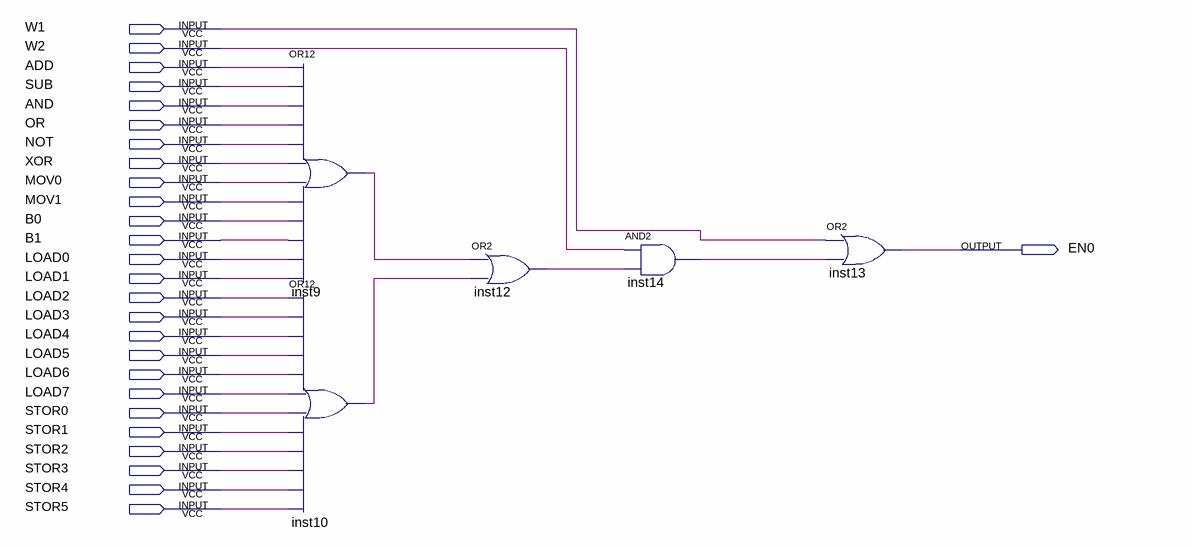
[diagram p0: schematic sheet]
// Quartus schematic EN0.bdf as structural Verilog: 5 symbols, 27 pins
module EN0 (
  input  W1,
  input  W2,
  input  ADD,
  input  SUB,
  input  AND,
  input  OR,
  input  NOT,
  input  XOR,
  input  MOV0,
  input  MOV1,
  input  B0,
  input  B1,
  input  LOAD0,
  input  LOAD1,
  input  LOAD2,
  input  LOAD3,
  input  LOAD4,
  input  LOAD5,
  input  LOAD6,
  input  LOAD7,
  input  STOR0,
  input  STOR1,
  input  STOR2,
  input  STOR3,
  input  STOR4,
  input  STOR5,
  output EN0
);

  wire inst9_out, inst10_out, inst12_out, inst14_out;

  or inst9 (inst9_out, ADD, SUB, AND, OR, NOT, XOR, MOV0, MOV1, B0, B1, LOAD0, LOAD1);
  or inst10 (inst10_out, LOAD2, LOAD3, LOAD4, LOAD5, LOAD6, LOAD7, STOR0, STOR1, STOR2, STOR3, STOR4, STOR5);
  or inst12 (inst12_out, inst9_out, inst10_out);
  and inst14 (inst14_out, W2, inst12_out);
  or inst13 (EN0, W1, inst14_out);
endmodule
